# Altium schematic sheet Mic_SPK.SchDoc
size A
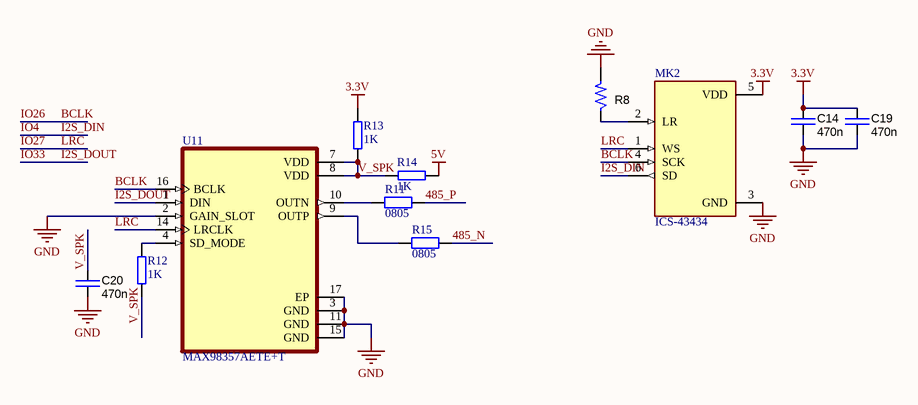
[diagram p0: Mic_SPK.SchDoc]

## Parts
C14  470n  [CAPC1608X90N]
C19  470n  [CAPC1608X90N]
C20  470n  [CAPC1608X90N]
MK2  ICS-43434  [MIC_ICS-43434]
R8  Thick Film  [RESC1608N_ZERO]  (value not drawn)
R11  value 0805  [DIEN TRO 0805]  (hidden comment: R0805)
R12  value 1K  [SMT0603]  (hidden comment: Resistor)
R13  value 1K  [SMT0603]  (hidden comment: Resistor)
R14  value 1K  [SMT0603]  (hidden comment: Resistor)
R15  value 0805  [DIEN TRO 0805]  (hidden comment: R0805)
U11  MAX98357AETE+T  [QFN50P300X300X80-17N]

## Nets
3.3V: C14.2 C19.2 MK2.5(VDD) R13.2
5V: R14.1
GND: C14.1 C19.1 C20.2 MK2.3(GND) R8.2 U11.2(GAIN_SLOT) U11.3(GND) U11.11(GND) U11.15(GND) U11.17(EP)
485_N: R15.2
485_P: R11.2
BCLK: MK2.4(SCK) U11.16(BCLK)  [also labelled IO26]
I2S_DIN: MK2.6(SD)  [also labelled IO4]
I2S_DOUT: U11.1(DIN)  [also labelled IO33]
IO27: MK2.1(WS) U11.14(LRCLK)  [also labelled LRC]
V_SPK: C20.1 R12.1 R13.1 R14.2 U11.7(VDD) U11.8(VDD)
NetMK2_2: MK2.2(LR) R8.1
NetR11_1: R11.1 U11.10(OUTN)
NetR12_2: R12.2 U11.4(SD_MODE)
NetR15_1: R15.1 U11.9(OUTP)

## Library data of the parts
C14 C19 C20 = CAP C_0603: Capacitor SMD Cer 470nF 10% 16V X7R 0603; Manufacturer 1: Murata Electronics North America; Manufacturer Part Number 1: GRM188R71C474KA88D; Ratings: 16V; X7R; Material: ceramic; SCDType: spec; Package / Case: 0603 (1608 metric); Tolerance: ±10%; Manufacturer 2: TDK Corporation; Manufacturer Part Number 2: C1608X7R1C474K; Supplier 1: Digi-Key; Supplier Part Number 1: 490-3295-2-ND; Supplier 2: Digi-Key; Supplier Part Number 2: 445-5192-2-ND; Supplier 3: Digi-Key; Supplier Part Number 3: 587-1250-2-ND; Manufacturer 3: Taiyo Yuden; Manufacturer Part Number 3: EMK107B7474KA-T; Manufacturer 4: Samsung; Manufacturer Part Number 4: CL10B474KONE; ComponentLink1URL: http://psearch.murata.com/capacitor/product/GRM188R71C474KA88#.pdf; ComponentLink1Description: http://psearch.murata.com/capacitor/product/GRM188R71C474KA88#.pdf; ComponentLink2URL: http://product.tdk.com/capacitor/mlcc/en/documents/mlcc_commercial_general_en.pdf; ComponentLink2Description: http://product.tdk.com/capacitor/mlcc/en/documents/mlcc_commercial_general_en.pdf; ComponentLink3URL: http://www.yuden.co.jp/or/product/category/capacitor/EMK107B7474KA-T.pdf; ComponentLink3Description: http://www.yuden.co.jp/or/product/category/capacitor/EMK107B7474KA-T.pdf; Value: 470n
MK2 = ICS-43434: 60Hz ~ 20kHz Digital, IÂ²S Microphone MEMS _Silicon_ 1.65V ~ 3.63V Omnidirectional _-26 Â±1dB @ 94dB SPL_ Solder Pads; MF: TDK InvenSense; Value: *; MP: ICS-43434; Package: TDK InvenSense; Price: None; Availability: Unavailable; SnapEDA_Link: https://www.snapeda.com/parts/ICS-43434/TDK%20InvenSense/view-part/4478548/?ref=snap
R8 = RES_0603: Resistor SMD chip 0.0 Ohm 0.1W 0603; Manufacturer 1: Vishay/Dale; Manufacturer Part Number 1: CRCW06030000Z0EA; Tolerance: ±5%; Ratings: 1/10W; SCDType: spec; Package / Case: 0603 (1608metric); Supplier 1: Digi-Key; Supplier Part Number 1: 541-0.0GCT-ND; ComponentLink1URL: http://www.vishay.com/doc?20035; ComponentLink1Description: http://www.vishay.com/doc?20035; Supplier 2: Digi-Key; Supplier Part Number 2: P0.0GTR-ND; Manufacturer 2: Panasonic Electronic Components; Manufacturer Part Number 2: ERJ-3GEY0R00V; RoHS 2: RoHS Compliant; ComponentLink2URL: http://industrial.panasonic.com/www-cgi/jvcr13pz.cgi?E+PZ+3+AOA0001+ERJ3GEY0R00V+7+WW; ComponentLink2Description: http://industrial.panasonic.com/www-cgi/jvcr13pz.cgi?E+PZ+3+AOA0001+ERJ3GEY0R00V+7+WW; Supplier 3: Digi-Key; Supplier Part Number 3: 311-0.0LECT-ND; Manufacturer 3: Yageo; Manufacturer Part Number 3: AC0603JR-070RL; RoHS 3: RoHS Compliant; ComponentLink3URL: http://www.yageo.com/documents/recent/PYu-AC_51_RoHS_L_2.pdf; ComponentLink3Description: http://www.yageo.com/documents/recent/PYu-AC_51_RoHS_L_2.pdf
R11 R15 = R0805: Resistor SMD 0805; Published: 8-Jun-2000; LatestRevisionDate: 17-Jul-2002; LatestRevisionNote: Re-released for DXP Platform.; PackageReference: AXIAL-0.4; Publisher: Altium Limited
R12-R14 = RES-SM-0603-1K: RES SM 0603 1K
U11 = MAX98357AETE+T: Amplifier IC 1-Channel _Mono_ Class D 16-TQFN _3x3_; MF: Maxim Integrated; MP: MAX98357AETE+T; Availability: Unavailable; SnapEDA_Link: https://www.snapeda.com/parts/MAX98357AETE%2BT/Maxim%20Integrated/view-part/48842/?ref=snap; Package: TQFN-16 Maxim; Price: None; Value: *